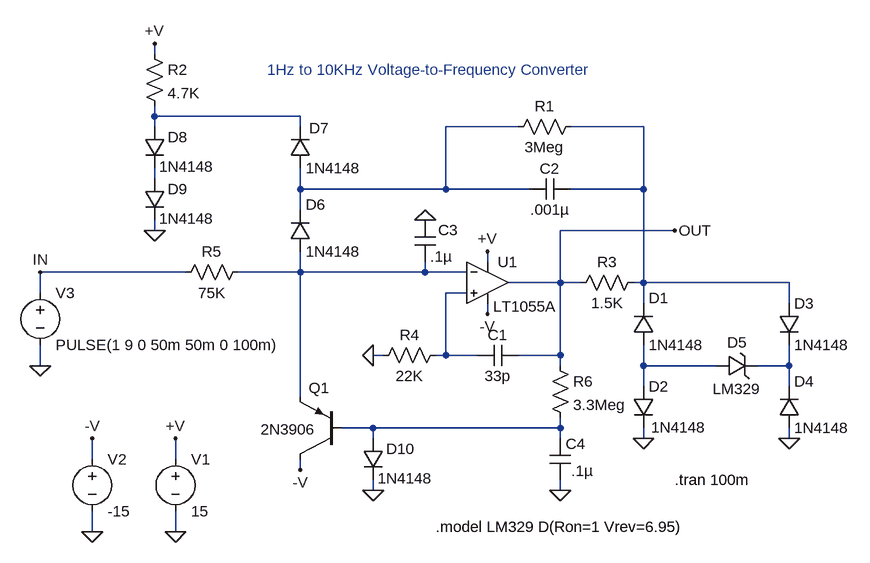
[diagram p0: schematic 1055A.asc]
1055A.asc, the LTspice schematic file:
Version 4
SHEET 1 896 688
WIRE -320 -112 -320 -128
WIRE -320 -16 -320 -32
WIRE -96 -16 -320 -16
WIRE -320 0 -320 -16
WIRE -96 0 -96 -16
WIRE 240 0 128 0
WIRE 432 0 320 0
WIRE -320 80 -320 64
WIRE -96 96 -96 64
WIRE 128 96 128 0
WIRE 128 96 -96 96
WIRE 256 96 128 96
WIRE 432 96 432 0
WIRE 432 96 320 96
WIRE -96 128 -96 96
WIRE -320 160 -320 144
WIRE 480 160 304 160
WIRE 192 208 192 192
WIRE -272 224 -496 224
WIRE -96 224 -96 192
WIRE -96 224 -192 224
WIRE 96 224 96 208
WIRE 96 224 -96 224
WIRE 160 224 96 224
WIRE 304 240 304 160
WIRE 304 240 224 240
WIRE 336 240 304 240
WIRE 432 240 432 96
WIRE 432 240 416 240
WIRE 656 240 432 240
WIRE -496 256 -496 224
WIRE 160 256 128 256
WIRE 432 272 432 240
WIRE 656 272 656 240
WIRE 192 288 192 272
WIRE 32 352 16 352
WIRE 128 352 128 256
WIRE 128 352 112 352
WIRE 176 352 128 352
WIRE 304 352 304 240
WIRE 304 352 240 352
WIRE -496 368 -496 336
WIRE 304 368 304 352
WIRE 432 368 432 336
WIRE 544 368 432 368
WIRE 656 368 656 336
WIRE 656 368 608 368
WIRE 432 400 432 368
WIRE 656 400 656 368
WIRE -96 416 -96 224
WIRE 16 464 -32 464
WIRE 304 464 304 448
WIRE 304 464 16 464
WIRE 16 480 16 464
WIRE 304 480 304 464
WIRE 432 480 432 464
WIRE 656 480 656 464
WIRE -416 512 -416 480
WIRE -288 512 -288 480
WIRE -96 528 -96 512
WIRE 16 560 16 544
WIRE 304 560 304 544
WIRE -416 624 -416 592
WIRE -288 624 -288 592
FLAG -288 624 0
FLAG 192 192 +V
FLAG -288 480 +V
FLAG 192 288 -V
FLAG -416 624 0
FLAG -416 480 -V
FLAG 432 480 0
FLAG 656 480 0
FLAG 96 144 0
FLAG -320 160 0
FLAG -320 -128 +V
FLAG 16 352 0
FLAG -496 368 0
FLAG 16 560 0
FLAG 304 560 0
FLAG -96 528 -V
FLAG 480 160 OUT
FLAG -496 224 IN
SYMBOL voltage -288 496 R0
SYMATTR InstName V1
SYMATTR Value 15
SYMBOL voltage -416 496 R0
SYMATTR InstName V2
SYMATTR Value -15
SYMBOL cap 240 336 R90
WINDOW 0 0 32 VBottom 0
WINDOW 3 32 32 VTop 0
SYMATTR InstName C1
SYMATTR Value 33p
SYMBOL res 320 256 R270
WINDOW 0 32 56 VTop 0
WINDOW 3 0 56 VBottom 0
SYMATTR InstName R3
SYMATTR Value 1.5K
SYMBOL diode 416 336 M180
WINDOW 0 24 72 Left 0
WINDOW 3 24 0 Left 0
SYMATTR InstName D1
SYMATTR Value 1N4148
SYMBOL diode 416 400 R0
WINDOW 3 28 63 Left 0
SYMATTR Value 1N4148
SYMATTR InstName D2
SYMBOL diode 640 272 R0
SYMATTR InstName D3
SYMATTR Value 1N4148
SYMBOL diode 640 464 M180
WINDOW 0 24 72 Left 0
WINDOW 3 24 0 Left 0
SYMATTR InstName D4
SYMATTR Value 1N4148
SYMBOL zener 544 384 R270
WINDOW 0 36 32 VTop 0
WINDOW 3 -4 32 VBottom 0
SYMATTR InstName D5
SYMATTR Value LM329
SYMBOL cap 320 80 R90
WINDOW 0 0 32 VBottom 0
WINDOW 3 32 32 VTop 0
SYMATTR InstName C2
SYMATTR Value .001µ
SYMBOL res 336 -16 R90
WINDOW 0 0 56 VBottom 0
WINDOW 3 32 56 VTop 0
SYMATTR InstName R1
SYMATTR Value 3Meg
SYMBOL cap 80 208 M180
WINDOW 0 36 49 Left 0
WINDOW 3 24 8 Left 0
SYMATTR InstName C3
SYMATTR Value .1µ
SYMBOL diode -112 192 M180
WINDOW 0 24 72 Left 0
WINDOW 3 24 0 Left 0
SYMATTR InstName D6
SYMATTR Value 1N4148
SYMBOL diode -112 64 M180
WINDOW 0 30 62 Left 0
WINDOW 3 24 0 Left 0
SYMATTR InstName D7
SYMATTR Value 1N4148
SYMBOL diode -336 80 R0
WINDOW 0 36 16 Left 0
WINDOW 3 23 61 Left 0
SYMATTR InstName D9
SYMATTR Value 1N4148
SYMBOL res -336 -128 R0
SYMATTR InstName R2
SYMATTR Value 4.7K
SYMBOL res 128 336 R90
WINDOW 0 0 56 VBottom 0
WINDOW 3 32 56 VTop 0
SYMATTR InstName R4
SYMATTR Value 22K
SYMBOL diode -336 0 R0
WINDOW 0 36 16 Left 0
WINDOW 3 23 61 Left 0
SYMATTR InstName D8
SYMATTR Value 1N4148
SYMBOL res -176 208 R90
WINDOW 0 0 56 VBottom 0
WINDOW 3 32 56 VTop 0
SYMATTR InstName R5
SYMATTR Value 75K
SYMBOL pnp -32 512 R180
WINDOW 0 51 110 Right 0
WINDOW 3 40 46 Left 0
SYMATTR InstName Q1
SYMATTR Value 2N3906
SYMBOL diode 0 480 R0
WINDOW 0 36 16 Left 0
WINDOW 3 23 61 Left 0
SYMATTR InstName D10
SYMATTR Value 1N4148
SYMBOL cap 288 480 R0
WINDOW 3 33 50 Left 0
SYMATTR Value .1µ
SYMATTR InstName C4
SYMBOL res 288 352 R0
SYMATTR InstName R6
SYMATTR Value 3.3Meg
SYMBOL voltage -496 240 R0
WINDOW 123 0 0 Left 0
WINDOW 39 0 0 Left 0
SYMATTR InstName V3
SYMATTR Value PULSE(1 9 0 50m 50m 0 100m)
SYMBOL opamps\\LT1055A 192 176 R0
WINDOW 3 9 101 Left 0
SYMATTR InstName U1
TEXT 112 616 Left 0 !.model LM329 D(Ron=1 Vrev=6.95)
TEXT 480 544 Left 0 !.tran 100m
TEXT 104 -72 Bottom 0 ;1Hz to 10KHz Voltage-to-Frequency Converter

The netlist it stands for:
* 1055A.asc
V1 +V 0 15
V2 -V 0 -15
C1 OUT N006 33p
R3 OUT N003 1.5K
D1 N007 N003 1N4148
D2 N007 0 1N4148
D3 N003 N008 1N4148
D4 0 N008 1N4148
D5 N007 N008 LM329
C2 N003 N002 .001µ
R1 N003 N002 3Meg
C3 N005 0 .1µ
D6 N005 N002 1N4148
D7 N002 N001 1N4148
D9 N004 0 1N4148
R2 +V N001 4.7K
R4 N006 0 22K
D8 N001 N004 1N4148
R5 N005 IN 75K
Q1 -V N009 N005 0 2N3906
D10 N009 0 1N4148
C4 N009 0 .1µ
R6 OUT N009 3.3Meg
V3 IN 0 PULSE(1 9 0 50m 50m 0 100m)
XU1 N006 N005 +V -V OUT LT1055A  ; pins In+ In- V+ V- OUT
.model D D
.lib standard.dio
.model NPN NPN
.model PNP PNP
.lib standard.bjt
.model LM329 D(Ron=1 Vrev=6.95)
.tran 100m
* 1Hz to 10KHz Voltage-to-Frequency Converter
.backanno
.end